# EAGLE design jam Digital (EAGLE 9.6.0)
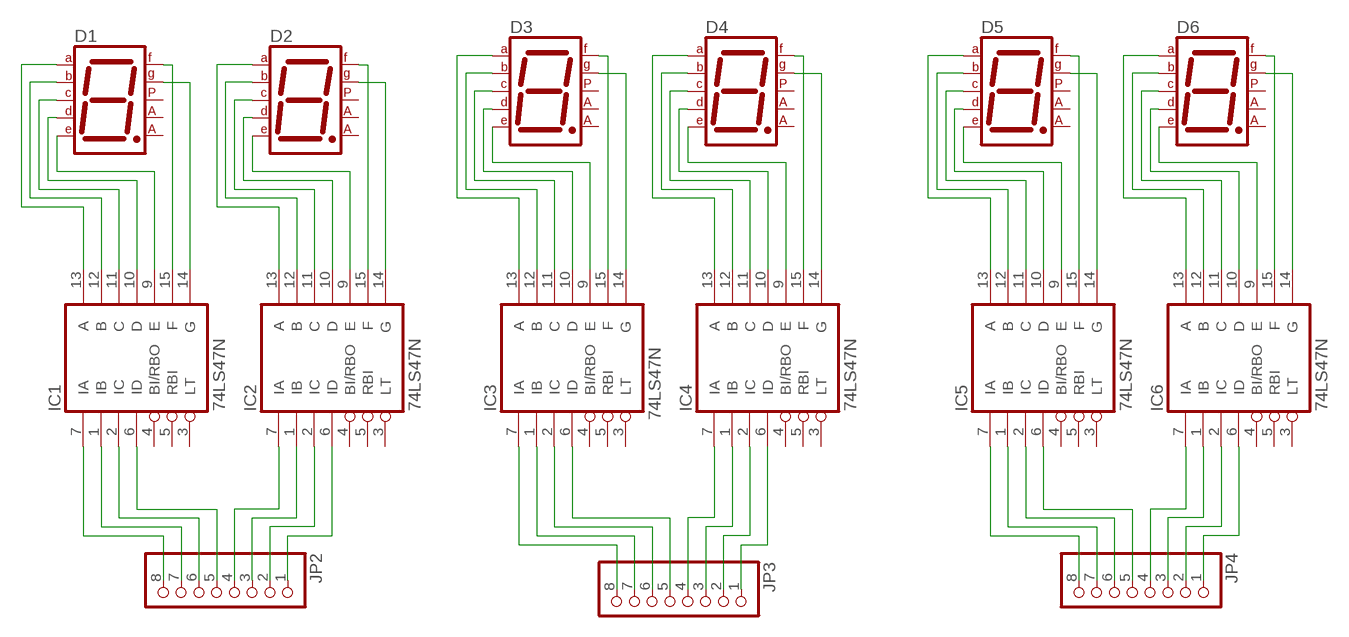
[diagram p0: schematic, sheet 1]

## Parts
D1  7SEG-CA  [7SEG-13]
D2  7SEG-CA  [7SEG-13]
D3  7SEG-CA  [7SEG-13]
D4  7SEG-CA  [7SEG-13]
D5  7SEG-CA  [7SEG-13]
D6  7SEG-CA  [7SEG-13]
IC1  74LS47N  [DIL16]
IC2  74LS47N  [DIL16]
IC3  74LS47N  [DIL16]
IC4  74LS47N  [DIL16]
IC5  74LS47N  [DIL16]
IC6  74LS47N  [DIL16]
JP2  PINHD-1X8  [1X08]
JP3  PINHD-1X8  [1X08]
JP4  PINHD-1X8  [1X08]

## Nets
N$7: D1.10(G) IC1.14(G)
N$8: D2.10(G) IC2.14(G)
N$9: D1.9(F) IC1.15(F)
N$10: D2.9(F) IC2.15(F)
N$11: D3.9(F) IC3.15(F)
N$12: D3.10(G) IC3.14(G)
N$13: D4.9(F) IC4.15(F)
N$14: D4.10(G) IC4.14(G)
N$15: D5.9(F) IC5.15(F)
N$16: D5.10(G) IC5.14(G)
N$17: D6.9(F) IC6.15(F)
N$18: D6.10(G) IC6.14(G)
N$19: D1.1(E) IC1.9(E)
N$20: D1.2(D) IC1.10(D)
N$21: D1.4(C) IC1.11(C)
N$22: D1.6(B) IC1.12(B)
N$23: D1.7(A) IC1.13(A)
N$24: D2.1(E) IC2.9(E)
N$25: D2.2(D) IC2.10(D)
N$26: D2.4(C) IC2.11(C)
N$27: D2.6(B) IC2.12(B)
N$28: D2.7(A) IC2.13(A)
N$29: D3.1(E) IC3.9(E)
N$30: D3.2(D) IC3.10(D)
N$31: D3.4(C) IC3.11(C)
N$32: D3.6(B) IC3.12(B)
N$33: D3.7(A) IC3.13(A)
N$34: D4.1(E) IC4.9(E)
N$35: D4.2(D) IC4.10(D)
N$36: D4.4(C) IC4.11(C)
N$37: D4.6(B) IC4.12(B)
N$38: D4.7(A) IC4.13(A)
N$39: D5.1(E) IC5.9(E)
N$40: D5.2(D) IC5.10(D)
N$41: D5.4(C) IC5.11(C)
N$42: D5.6(B) IC5.12(B)
N$43: D5.7(A) IC5.13(A)
N$44: D6.1(E) IC6.9(E)
N$45: D6.2(D) IC6.10(D)
N$46: D6.4(C) IC6.11(C)
N$47: D6.6(B) IC6.12(B)
N$48: D6.7(A) IC6.13(A)
N$49: IC1.7(IA) JP2.8
N$50: IC1.1(IB) JP2.7
N$51: IC1.2(IC) JP2.6
N$52: IC1.6(ID) JP2.5
N$53: IC2.7(IA) JP2.4
N$54: IC2.1(IB) JP2.3
N$55: IC2.2(IC) JP2.2
N$56: IC2.6(ID) JP2.1
N$57: IC3.7(IA) JP3.8
N$58: IC3.1(IB) JP3.7
N$59: IC3.2(IC) JP3.6
N$60: IC3.6(ID) JP3.5
N$61: IC4.7(IA) JP3.4
N$62: IC4.1(IB) JP3.3
N$63: IC4.2(IC) JP3.2
N$64: IC4.6(ID) JP3.1
N$65: IC5.7(IA) JP4.8
N$66: IC5.1(IB) JP4.7
N$67: IC5.2(IC) JP4.6
N$68: IC5.6(ID) JP4.5
N$69: IC6.7(IA) JP4.4
N$70: IC6.1(IB) JP4.3
N$71: IC6.2(IC) JP4.2
N$72: IC6.6(ID) JP4.1
Unconnected: D1.3(CA1) D1.5(DP) D1.8(CA2) D2.3(CA1) D2.5(DP) D2.8(CA2) D3.3(CA1) D3.5(DP) D3.8(CA2) D4.3(CA1) D4.5(DP) D4.8(CA2) D5.3(CA1) D5.5(DP) D5.8(CA2) D6.3(CA1) D6.5(DP) D6.8(CA2) IC1.3(LT) IC1.4(BI/RBO) IC1.5(RBI) IC2.3(LT) IC2.4(BI/RBO) IC2.5(RBI) IC3.3(LT) IC3.4(BI/RBO) IC3.5(RBI) IC4.3(LT) IC4.4(BI/RBO) IC4.5(RBI) IC5.3(LT) IC5.4(BI/RBO) IC5.5(RBI) IC6.3(LT) IC6.4(BI/RBO) IC6.5(RBI)

## Power pins joined to a net without a drawn wire
GND: IC1.8(GND) IC2.8(GND) IC3.8(GND) IC4.8(GND) IC5.8(GND) IC6.8(GND)
VCC: IC1.16(VCC) IC2.16(VCC) IC3.16(VCC) IC4.16(VCC) IC5.16(VCC) IC6.16(VCC)

## Library data of the parts
D1-D6 = special:7SEG-CA: 7-segment DISPLAY single anode, 13 mm
IC1-IC6 = 74xx-eu:74*47: BCD to seven segment DECODER/DRIVER Source: http://www.ee.washington.edu/stores/DataSheets/74ls/74ls47.pdf
JP2-JP4 = pinhead:PINHD-1X8: PIN HEADER

## Board
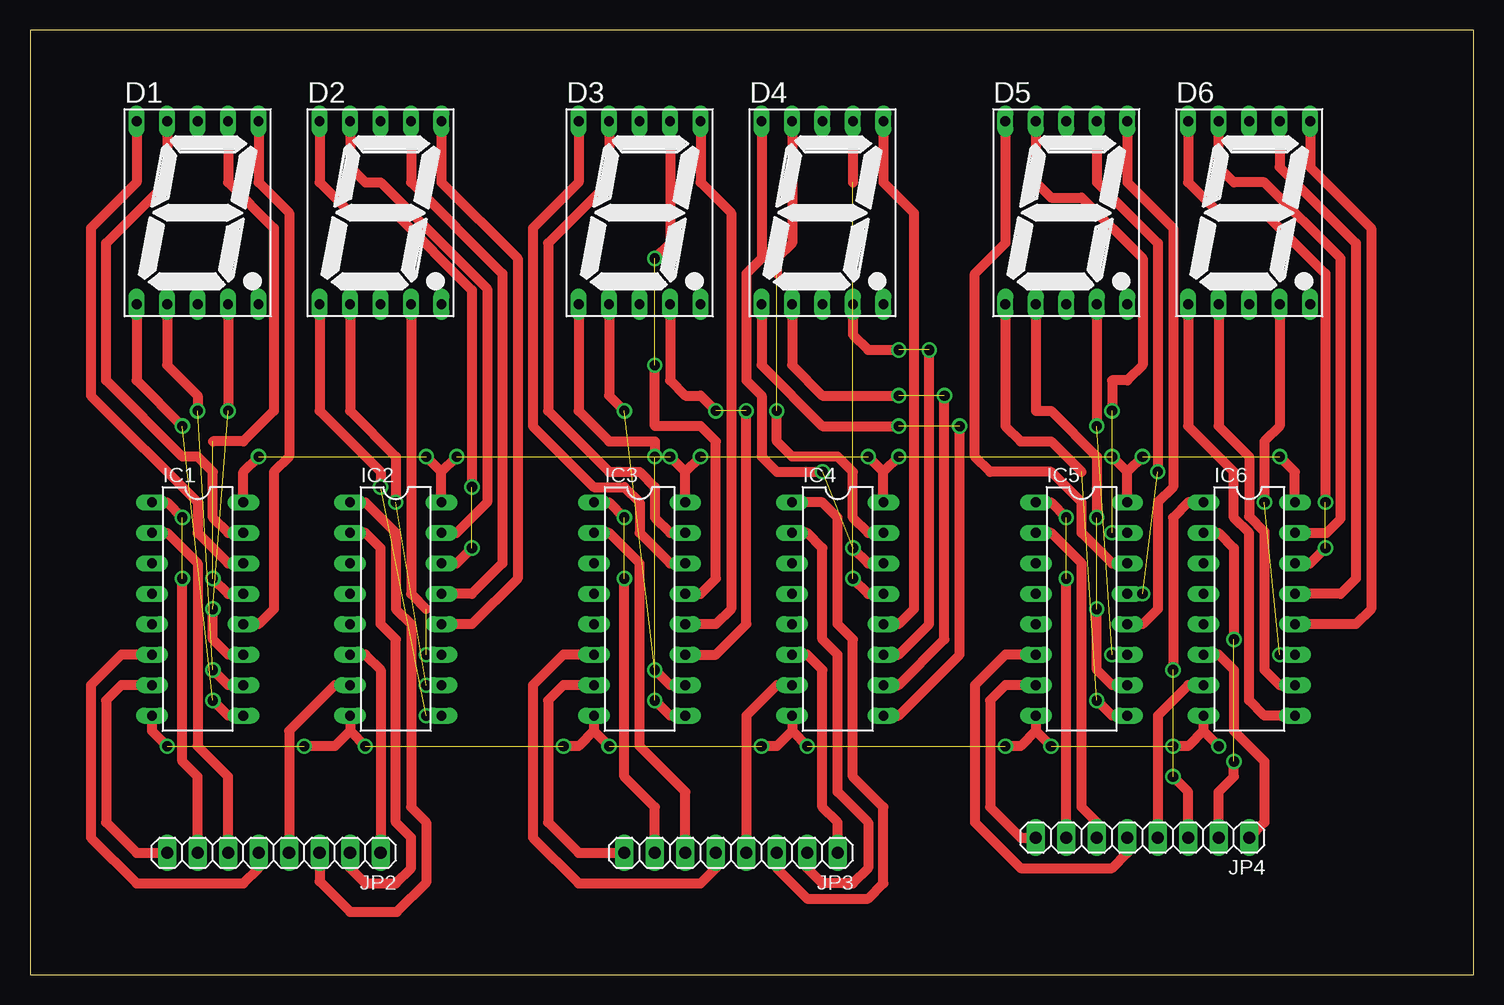
[diagram p1: board, top side]

Size 120.32 x 78.73 mm. Coordinates in mm from the lower left corner, seen from the top.
Outline: 0,0 120.32,0 120.32,78.73 0,78.73 0,0
Copper layers (1*16): Top 0.035mm / dielectric 1.5mm / Bottom 0.035mm
Design rules "default": minimum track width 6mil, minimum drill 0.35mm, track to track 6mil, track to pad 6mil, pad to pad 6mil, via to via 6mil, smd to smd 6mil, copper to edge 40mil, drill to drill 6mil, minimum pad ring 10mil, minimum via ring 8mil, stop-mask expansion 4mil, vias tented up to drill 0mil, thermal gap 10mil

### Footprints (pad centres in the part's own frame; a part is rotated, then mirrored left to right if it is on the bottom)
7SEG-13 = drill 0.813 long: 1 -5.08,-7.62; 2 -2.54,-7.62; 3 0,-7.62; 4 2.54,-7.62; 5 5.08,-7.62; 6 5.08,7.62; 7 2.54,7.62; 8 0,7.62; 9 -2.54,7.62; 10 -5.08,7.62
DIL16 = drill 0.813 long: 1 -8.89,-3.81; 2 -6.35,-3.81; 3 -3.81,-3.81; 4 -1.27,-3.81; 5 1.27,-3.81; 6 3.81,-3.81; 7 6.35,-3.81; 8 8.89,-3.81; 9 8.89,3.81; 10 6.35,3.81; 11 3.81,3.81; 12 1.27,3.81; 13 -1.27,3.81; 14 -3.81,3.81; 15 -6.35,3.81; 16 -8.89,3.81
1X08 = drill 1.016 long: 1 -8.89,0; 2 -6.35,0; 3 -3.81,0; 4 -1.27,0; 5 1.27,0; 6 3.81,0; 7 6.35,0; 8 8.89,0

### Placement (x,y rotation side)
D1  13.97,63.5 0 top
D2  29.21,63.5 0 top
D3  50.8,63.5 0 top
D4  66.04,63.5 0 top
D5  86.36,63.5 0 top
D6  101.6,63.5 0 top
IC1  13.97,30.48 270 top
IC2  30.48,30.48 270 top
IC3  50.8,30.48 270 top
IC4  67.31,30.48 270 top
IC5  87.63,30.48 270 top
IC6  101.6,30.48 270 top
JP2  20.32,10.16 180 top
JP3  58.42,10.16 180 top
JP4  92.71,11.43 180 top

### Tracks (layer width: path | path; a pad name or v marks a point on that pad's centre or on a via)
GND  (via drill 0.85)  (5 unrouted)
  Top 0.813: IC1.8 10.16,20.32 v11.43,19.05 | IC2.8 26.67,20.32 | 26.67,20.32 v27.94,19.05 | IC3.8 46.99,20.32 | 46.99,20.32 v48.26,19.05 | IC4.8 63.5,20.32 | 63.5,20.32 v64.77,19.05 | IC5.8 83.82,20.32 | v85.09,19.05 83.82,20.32 | IC6.8 97.79,20.32 | v99.06,19.05 97.79,20.32 | 26.67,20.32 25.4,19.05 v22.86,19.05 | 46.99,20.32 45.72,19.05 v44.45,19.05 | 63.5,20.32 62.23,19.05 v60.96,19.05 | 83.82,20.32 82.55,19.05 v81.28,19.05 | 97.79,20.32 96.52,19.05 v95.25,19.05
N$7
  Top 0.813: D1.10 8.89,66.04 5.08,62.23 5.08,48.26 13.97,39.37 13.97,36.83 16.51,34.29 IC1.14
N$8  (via drill 0.85)  (1 unrouted)
  Top 0.813: D2.10 24.13,66.04 26.67,63.5 30.39,63.5 36.83,57.05 v36.83,40.64 | IC2.14 35.56,34.29 v36.83,35.56
N$9
  Top 0.813: D1.9 11.43,66.04 6.35,60.96 6.35,49.53 12.7,43.18 13.97,43.18 15.24,41.91 15.24,38.1 16.51,36.83 IC1.15
N$10
  Top 0.813: IC2.15 35.56,36.83 38.1,39.37 38.1,57.15 29.21,66.04 27.94,66.04 26.67,67.31 D2.9
N$11
  Top 0.813: D3.9 48.26,66.04 43.18,60.96 43.18,46.99 48.26,41.91 50.8,41.91 52.07,40.64 52.07,38.1 53.34,36.83 IC3.15
N$12
  Top 0.813: D3.10 45.72,66.04 41.91,62.23 41.91,45.72 46.99,40.64 49.53,40.64 50.8,39.37 50.8,36.83 53.34,34.29 IC3.14
N$13  (via drill 0.85)  (1 unrouted)
  Top 0.813: IC4.15 69.85,36.83 68.58,38.1 68.58,41.91 67.31,43.18 63.5,43.18 62.23,44.45 v62.23,46.99 | D4.9 63.5,60.96 62.23,59.69 62.23,58.42
N$14  (via drill 0.85)  (1 unrouted)
  Top 0.813: v66.04,41.91 62.23,41.91 60.96,43.18 60.96,48.26 59.69,49.53 59.69,58.42 60.96,59.69 D4.10 | IC4.14 69.85,34.29 v68.58,35.56
N$15  (via drill 0.85)  (1 unrouted)
  Top 0.813: D5.9 83.82,66.04 85.09,64.77 87.63,64.77 92.71,59.69 92.71,50.8 91.44,49.53 90.17,49.53 v90.17,46.99 | IC5.15 v90.17,36.83
N$16
  Top 0.813: IC5.14 90.17,34.29 87.63,36.83 87.63,39.37 85.09,41.91 80.01,41.91 78.74,43.18 78.74,58.42 81.28,60.96 D5.10
N$17
  Top 0.813: D6.9 99.06,67.31 100.33,66.04 102.87,66.04 109.22,59.69 109.22,38.01 108.05,36.83 IC6.15
N$18  (via drill 0.85)  (1 unrouted)
  Top 0.813: D6.10 96.52,66.04 99.06,63.5 102.87,63.5 107.95,58.42 v107.95,39.37 | IC6.14 106.68,34.29 v107.95,35.56
N$19  (via drill 0.85)  (1 unrouted)
  Top 0.813: IC1.9 16.51,21.59 v15.24,22.86 | D1.1 8.89,49.53 v12.7,45.72
N$20  (via drill 0.85)  (1 unrouted)
  Top 0.813: IC1.10 16.51,24.13 v15.24,25.4 | D1.2 11.43,50.8 13.97,48.26 v13.97,46.99
N$21  (via drill 0.85)  (1 unrouted)
  Top 0.813: IC1.11 16.51,26.67 15.24,27.94 v15.24,30.48 | D1.4 v16.51,46.99
N$22
  Top 0.813: D1.6 19.05,66.04 21.59,63.5 21.59,43.18 20.32,41.91 20.32,30.48 19.05,29.21 IC1.12
N$23  (via drill 0.85)  (1 unrouted)
  Top 0.813: D1.7 16.51,66.04 20.32,62.23 20.32,46.99 17.78,44.45 15.24,44.45 | IC1.13 16.51,31.75 v15.24,33.02
N$24  (via drill 0.85)  (1 unrouted)
  Top 0.813: D2.1 24.13,46.99 29.21,41.91 v29.21,40.64 | IC2.9 v33.02,21.59
N$25  (via drill 0.85)  (1 unrouted)
  Top 0.813: D2.2 26.67,46.99 30.48,43.18 v30.48,39.37 | IC2.10 v33.02,24.13
N$26  (via drill 0.85)  (1 unrouted)
  Top 0.813: D2.4 31.75,31.75 33.02,30.48 | IC2.11 v33.02,26.67
N$27
  Top 0.813: D2.6 34.29,66.04 40.64,59.69 40.64,33.02 36.83,29.21 IC2.12
N$28
  Top 0.813: D2.7 31.75,66.04 39.37,58.42 39.37,34.29 36.83,31.75 IC2.13
N$29  (via drill 0.85)  (1 unrouted)
  Top 0.813: D3.1 45.72,46.99 48.26,44.45 52.07,44.45 v52.07,43.18 | IC3.9 53.34,21.59 v52.07,22.86
N$30  (via drill 0.85)  (1 unrouted)
  Top 0.813: IC3.10 53.34,24.13 v52.07,25.4 | D3.2 48.26,48.26 v49.53,46.99
N$31  (via drill 0.85)  (1 unrouted)
  Top 0.813: D3.4 53.34,49.53 54.61,48.26 55.88,48.26 v57.15,46.99 | IC3.11 57.15,26.67 59.69,29.21 v59.69,46.99
N$32
  Top 0.813: D3.6 55.88,66.04 58.42,63.5 58.42,30.48 57.15,29.21 IC3.12
N$33  (via drill 0.85)  (1 unrouted)
  Top 0.813: v52.07,59.69 53.34,60.96 D3.7 | IC3.13 55.88,31.75 57.15,33.02 57.15,44.45 55.88,45.72 52.07,45.72 v52.07,50.8
N$34  (via drill 0.85)  (1 unrouted)
  Top 0.813: IC4.9 72.39,21.59 77.47,26.67 v77.47,45.72 | D4.1 60.96,50.8 66.04,45.72 v72.39,45.72
N$35  (via drill 0.85)  (1 unrouted)
  Top 0.813: IC4.10 72.39,24.13 76.2,27.94 v76.2,48.26 | D4.2 63.5,50.8 66.04,48.26 v72.39,48.26
N$36  (via drill 0.85)  (1 unrouted)
  Top 0.813: IC4.11 72.39,26.67 74.93,29.21 v74.93,52.07 | D4.4 68.58,53.34 69.85,52.07 v72.39,52.07
N$37
  Top 0.813: D4.6 71.12,66.04 73.66,63.5 73.66,30.48 72.39,29.21 IC4.12
N$38  (via drill 0.85)  (1 unrouted)
  Top 0.813: D4.7 68.58,66.04 | IC4.13 69.85,31.75 v68.58,33.02
N$39  (via drill 0.85)  (1 unrouted)
  Top 0.813: IC5.9 90.17,21.59 v88.9,22.86 | D5.1 81.28,45.72 82.55,44.45 85.09,44.45 87.63,41.91
N$40  (via drill 0.85)  (1 unrouted)
  Top 0.813: IC5.10 90.17,24.13 88.9,25.4 v88.9,30.48 | v88.9,38.1 88.9,43.18 85.09,46.99 83.82,46.99 D5.2
N$41  (via drill 0.85)  (1 unrouted)
  Top 0.813: IC5.11 v90.17,26.67 | D5.4 v88.9,45.72
N$42
  Top 0.813: D5.6 91.44,66.04 95.25,62.23 95.25,40.64 93.98,39.37 93.98,30.48 92.71,29.21 IC5.12
N$43  (via drill 0.85)  (1 unrouted)
  Top 0.813: D5.7 88.9,66.04 93.98,60.96 v93.98,41.91 | IC5.13 v92.71,31.75
N$44
  Top 0.813: D6.1 96.52,45.72 100.33,41.91 100.33,38.1 101.6,36.83 101.6,22.86 102.87,21.59 IC6.9 104.14,21.59
N$45
  Top 0.813: D6.2 99.06,45.72 101.6,43.18 101.6,38.2 102.87,36.92 102.87,25.4 104.14,24.13 IC6.10
N$46  (via drill 0.85)  (1 unrouted)
  Top 0.813: IC6.11 v104.14,26.67 | D6.4 104.14,45.72 102.87,44.45 v102.87,39.37
N$47
  Top 0.813: 106.68,29.21 IC6.12 110.49,29.21 111.76,30.48 111.76,62.23 106.68,67.31 D6.6
N$48
  Top 0.813: D6.7 104.14,67.31 110.49,60.96 110.49,33.02 109.22,31.75 IC6.13
N$49
  Top 0.813: IC1.7 7.62,24.13 6.35,22.86 6.35,12.7 8.89,10.16 JP2.8
N$50  (via drill 0.85)  (1 unrouted)
  Top 0.813: IC1.1 11.43,39.37 v12.7,38.1 | JP2.7 13.97,16.51 12.7,17.78 v12.7,33.02
N$51
  Top 0.813: IC1.2 11.43,36.83 13.97,34.29 13.97,19.05 16.51,16.51 JP2.6
N$52
  Top 0.813: IC1.6 7.62,26.67 5.08,24.13 5.08,11.43 8.89,7.62 17.78,7.62 19.05,8.89 JP2.5
N$53
  Top 0.813: IC2.7 25.4,24.13 21.59,20.32 JP2.4
N$54
  Top 0.813: JP2.3 24.13,7.77 26.67,5.23 30.57,5.23 33.02,7.68 33.02,12.7 31.75,13.97 31.75,29.21 30.48,30.48 30.48,36.83 27.94,39.37 IC2.1
N$55
  Top 0.813: JP2.2 26.67,8.89 27.94,7.62 30.48,7.62 31.75,8.89 31.75,11.43 30.48,12.7 30.48,27.94 29.21,29.21 29.21,35.56 27.94,36.83 IC2.2
N$56
  Top 0.813: IC2.6 27.94,26.67 29.21,25.4 JP2.1
N$57
  Top 0.813: IC3.7 44.45,24.13 43.18,22.86 43.18,12.7 45.72,10.16 JP3.8
N$58  (via drill 0.85)  (1 unrouted)
  Top 0.813: JP3.7 52.07,13.97 49.53,16.51 v49.53,33.02 | IC3.1 48.26,39.37 v49.53,38.1
N$59
  Top 0.813: IC3.2 48.26,36.83 50.8,34.29 50.8,19.05 54.61,15.24 JP3.6
N$60
  Top 0.813: IC3.6 44.45,26.67 41.91,24.13 41.91,11.43 45.72,7.62 55.88,7.62 57.15,8.89 JP3.5
N$61
  Top 0.813: IC4.7 62.23,24.13 59.69,21.59 JP3.4
N$62
  Top 0.813: JP3.3 62.23,8.89 64.77,6.35 69.85,6.35 71.12,7.62 71.12,13.97 68.58,16.51 68.58,27.94 67.31,29.21 67.31,38.1 66.04,39.37 IC4.1
N$63
  Top 0.813: JP3.2 64.77,8.89 66.04,7.62 68.58,7.62 69.85,8.89 69.85,12.7 67.31,15.24 67.31,26.67 66.04,27.94 66.04,35.56 64.77,36.83 IC4.2
N$64
  Top 0.813: IC4.6 64.77,26.67 66.04,25.4 66.04,13.97 67.31,12.7 JP3.1
N$65
  Top 0.813: IC5.7 81.28,24.13 80.01,22.86 80.01,13.97 82.55,11.43 JP4.8
N$66  (via drill 0.85)  (1 unrouted)
  Top 0.813: IC5.1 85.09,39.37 v86.36,38.1 | JP4.7 v86.36,33.02
N$67
  Top 0.813: IC5.2 85.09,36.83 87.63,34.29 87.63,13.97 88.9,12.7 JP4.6
N$68
  Top 0.813: IC5.6 81.28,26.67 78.74,24.13 78.74,12.7 82.55,8.89 90.17,8.89 91.44,10.16 JP4.5
N$69
  Top 0.813: IC6.7 96.52,24.13 93.98,21.59 JP4.4
N$70  (via drill 0.85)  (1 unrouted)
  Top 0.813: IC6.1 96.52,39.37 95.25,38.1 v95.25,25.4 | v95.25,16.51 96.52,15.24 JP4.3
N$71  (via drill 0.85)  (1 unrouted)
  Top 0.813: IC6.2 99.06,36.83 100.33,35.56 v100.33,27.94 | JP4.2 99.06,15.24 100.33,16.51 v100.33,17.78
N$72
  Top 0.813: IC6.6 99.06,26.67 100.33,25.4 100.33,20.32 102.87,17.78 102.87,12.7 JP4.1
VCC  (via drill 0.85)  (5 unrouted)
  Top 0.813: v19.05,43.18 17.78,41.91 IC1.16 | v33.02,43.18 34.29,41.91 | IC2.16 34.29,41.91 | 34.29,41.91 v35.56,43.18 | 54.61,41.91 v53.34,43.18 | IC3.16 54.61,41.91 | 54.61,41.91 v55.88,43.18 | v72.39,43.18 71.12,41.91 | IC4.16 71.12,41.91 | 71.12,41.91 v69.85,43.18 | v92.71,43.18 91.44,41.91 | IC5.16 91.44,41.91 | 91.44,41.91 v90.17,43.18 | v104.14,43.18 105.41,41.91 IC6.16